# EAGLE design lipolski (EAGLE 7.7.0)
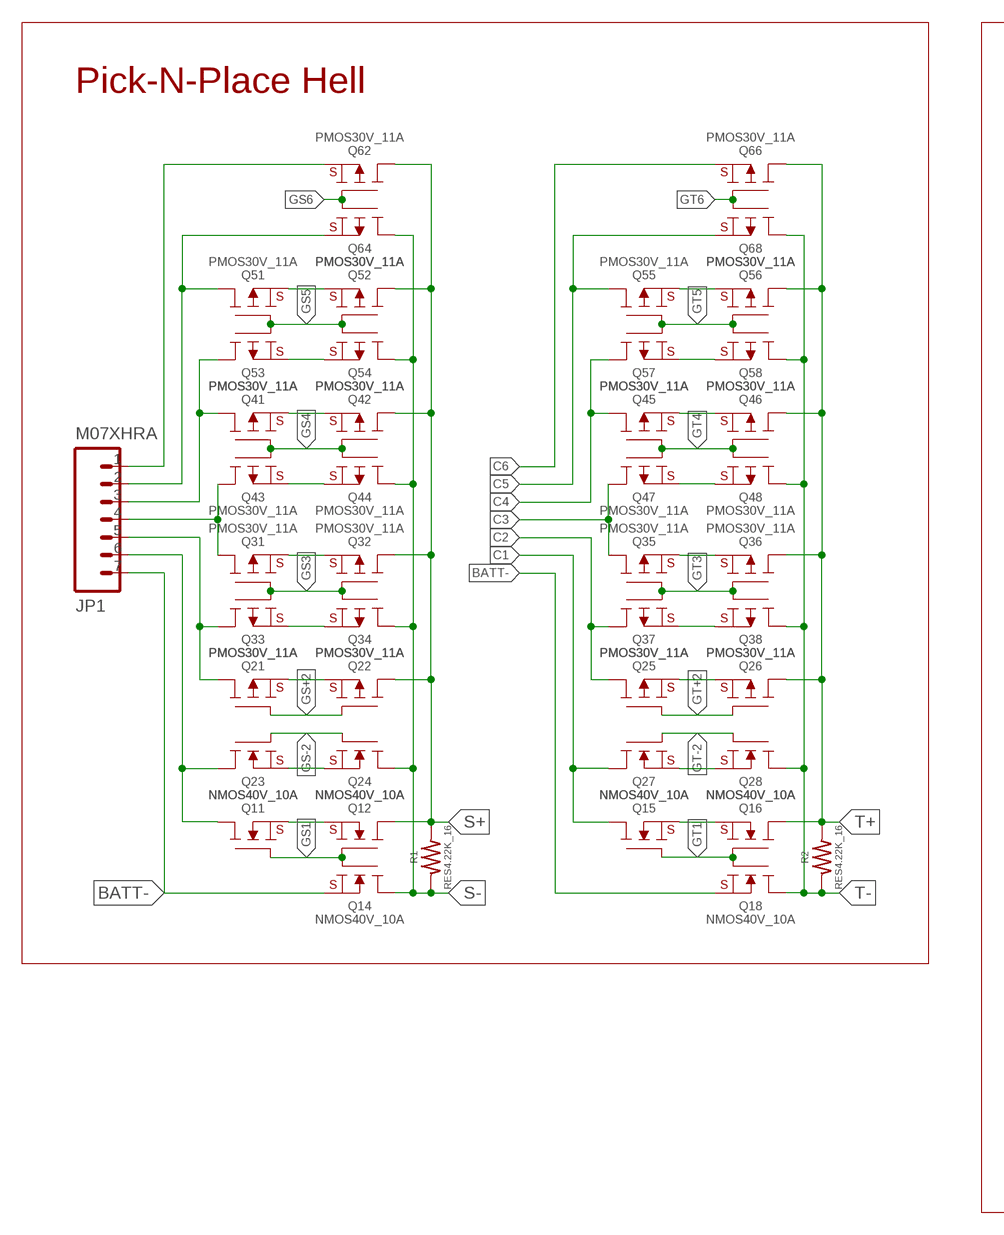
[diagram p0: schematic, sheet 1, part 1 of 2]
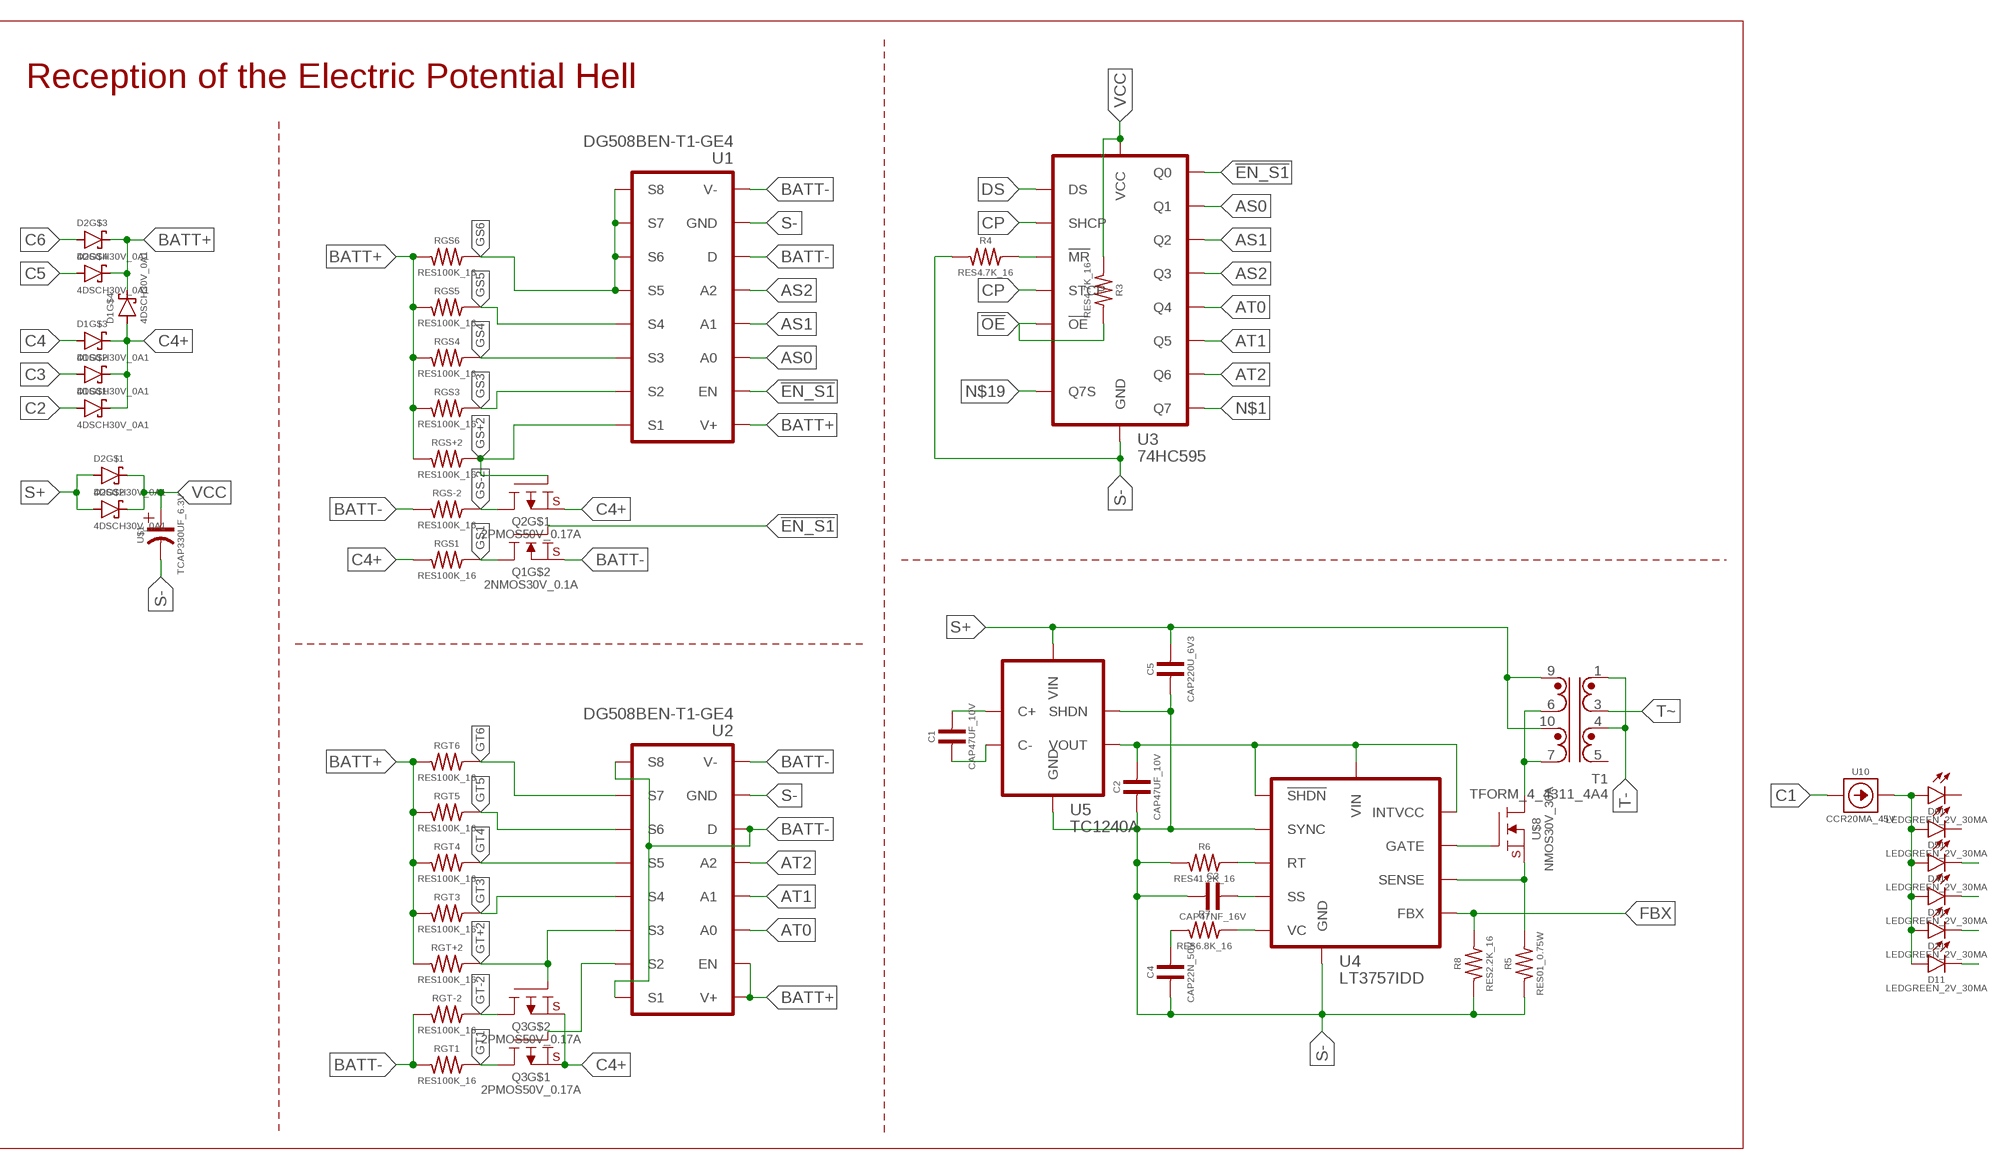
[diagram p1: schematic, sheet 1, part 2 of 2]

## Parts
C1  CAP47UF_10V  [0805]
C2  CAP47UF_10V  [0805]
C3  CAP47NF_16V  [0201P]
C4  CAP22N_50V  [0402]
C5  CAP220U_6V3  [1210]
D1  4DSCH30V_0A1  [8-HMD]
D2  4DSCH30V_0A1  [8-HMD]
D11  LEDGREEN_2V_30MA  [0603+]
D21  LEDGREEN_2V_30MA  [0603+]
D31  LEDGREEN_2V_30MA  [0603+]
D41  LEDGREEN_2V_30MA  [0603+]
D51  LEDGREEN_2V_30MA  [0603+]
D61  LEDGREEN_2V_30MA  [0603+]
JP1  M07XHRA  [XH07-RA]
Q1  2NMOS30V_0.1A  [SOT-666]
Q2  2PMOS50V_0.17A  [SOT-666]
Q3  2PMOS50V_0.17A  [SOT-666]
Q11  NMOS40V_10A  [6-POWERWDFN]
Q12  NMOS40V_10A  [6-POWERWDFN]
Q14  NMOS40V_10A  [6-POWERWDFN]
Q15  NMOS40V_10A  [6-POWERWDFN]
Q16  NMOS40V_10A  [6-POWERWDFN]
Q18  NMOS40V_10A  [6-POWERWDFN]
Q21  PMOS30V_11A  [6-POWERWDFN]
Q22  PMOS30V_11A  [6-POWERWDFN]
Q23  NMOS40V_10A  [6-POWERWDFN]
Q24  NMOS40V_10A  [6-POWERWDFN]
Q25  PMOS30V_11A  [6-POWERWDFN]
Q26  PMOS30V_11A  [6-POWERWDFN]
Q27  NMOS40V_10A  [6-POWERWDFN]
Q28  NMOS40V_10A  [6-POWERWDFN]
Q31  PMOS30V_11A  [6-POWERWDFN]
Q32  PMOS30V_11A  [6-POWERWDFN]
Q33  PMOS30V_11A  [6-POWERWDFN]
Q34  PMOS30V_11A  [6-POWERWDFN]
Q35  PMOS30V_11A  [6-POWERWDFN]
Q36  PMOS30V_11A  [6-POWERWDFN]
Q37  PMOS30V_11A  [6-POWERWDFN]
Q38  PMOS30V_11A  [6-POWERWDFN]
Q41  PMOS30V_11A  [6-POWERWDFN]
Q42  PMOS30V_11A  [6-POWERWDFN]
Q43  PMOS30V_11A  [6-POWERWDFN]
Q44  PMOS30V_11A  [6-POWERWDFN]
Q45  PMOS30V_11A  [6-POWERWDFN]
Q46  PMOS30V_11A  [6-POWERWDFN]
Q47  PMOS30V_11A  [6-POWERWDFN]
Q48  PMOS30V_11A  [6-POWERWDFN]
Q51  PMOS30V_11A  [6-POWERWDFN]
Q52  PMOS30V_11A  [6-POWERWDFN]
Q53  PMOS30V_11A  [6-POWERWDFN]
Q54  PMOS30V_11A  [6-POWERWDFN]
Q55  PMOS30V_11A  [6-POWERWDFN]
Q56  PMOS30V_11A  [6-POWERWDFN]
Q57  PMOS30V_11A  [6-POWERWDFN]
Q58  PMOS30V_11A  [6-POWERWDFN]
Q62  PMOS30V_11A  [6-POWERWDFN]
Q64  PMOS30V_11A  [6-POWERWDFN]
Q66  PMOS30V_11A  [6-POWERWDFN]
Q68  PMOS30V_11A  [6-POWERWDFN]
R1  RES4.22K_16  [0402]
R2  RES4.22K_16  [0402]
R3  RES4.7K_16  [0402]
R4  RES4.7K_16  [0402]
R5  RES01_0.75W  [1206]
R6  RES41.2K_16  [0402]
R7  RES6.8K_16  [0402]
R8  RES2.2K_16  [0402]
RGS1  RES100K_16  [0402]
RGS3  RES100K_16  [0402]
RGS4  RES100K_16  [0402]
RGS5  RES100K_16  [0402]
RGS6  RES100K_16  [0402]
RGS+2  RES100K_16  [0402]
RGS-2  RES100K_16  [0402]
RGT1  RES100K_16  [0402]
RGT3  RES100K_16  [0402]
RGT4  RES100K_16  [0402]
RGT5  RES100K_16  [0402]
RGT6  RES100K_16  [0402]
RGT+2  RES100K_16  [0402]
RGT-2  RES100K_16  [0402]
T1  TFORM_4_4311_4A4  [EPQ13]
U1  DG508BEN-T1-GE4  [MINIQFN-16L]
U2  DG508BEN-T1-GE4  [MINIQFN-16L]
U3  74HC595  [16-VFQFN]
U4  LT3757IDD  [10-WFDFN]
U5  TC1240A  [SOT-23-6]
U10  CCR20MA_45V  [SOD-123]
U$1  TCAP330UF_6.3V  [1210+]
U$8  NMOS30V_30A  [8-POWERWDFN]

## Nets
!EN_S1: Q1.5(G) U1.16(EN) U3.15(Q0)
!OE: R3.2 U3.13(!OE)
AS0: U1.15(A0) U3.1(Q1)
AS1: U1.14(A1) U3.2(Q2)
AS2: U1.13(A2) U3.3(Q3)
AT0: U2.15(A0) U3.4(Q4)
AT1: U2.14(A1) U3.5(Q5)
AT2: U2.13(A2) U3.6(Q6)
BATT+: D1.5(C) D2.5(C) D2.6(C) RGS3.1 RGS4.1 RGS5.1 RGS6.1 RGS+2.1 RGT3.1 RGT4.1 RGT5.1 RGT6.1 RGT+2.1 U1.11(V+) U2.11(V+) U2.16(EN)
BATT-: JP1.7 Q1.4(S) Q14.S Q18.S RGS-2.1 RGT1.1 RGT-2.1 U1.1(V-) U1.6(D) U2.1(V-) U2.2(S1) U2.6(D) U2.7(S8)
C1: JP1.6 Q11.D Q15.D Q23.D Q27.D U10.A
C2: D1.1(A) JP1.5 Q21.D Q25.D Q33.D Q37.D
C3: D1.2(A) JP1.4 Q31.D Q35.D Q43.D Q47.D
C4: D1.3(A) JP1.3 Q41.D Q45.D Q53.D Q57.D
C4+: D1.4(A) D1.6(C) D1.7(C) D1.8(C) Q2.1(S) Q3.1(S) Q3.4(S) RGS1.1
C5: D2.4(A) JP1.2 Q51.D Q55.D Q64.S Q68.S
C6: D2.3(A) JP1.1 Q62.S Q66.S
CP: U3.11(SHCP) U3.12(STCP)
DS: U3.14(DS)
FBX: R8.2 U4.2(FBX)
GS1: Q1.3(D) Q11.G Q12.G Q14.G RGS1.2
GS3: Q31.G Q32.G Q33.G Q34.G RGS3.2 U1.3(S2)
GS4: Q41.G Q42.G Q43.G Q44.G RGS4.2 U1.4(S3)
GS5: Q51.G Q52.G Q53.G Q54.G RGS5.2 U1.5(S4)
GS6: Q62.G Q64.G RGS6.2 U1.7(S8) U1.8(S7) U1.9(S6) U1.10(S5)
GS+2: Q2.2(G) Q21.G Q22.G RGS+2.2 U1.2(S1)
GS-2: Q2.6(D) Q23.G Q24.G RGS-2.2
GT1: Q3.6(D) Q15.G Q16.G Q18.G RGT1.2
GT3: Q35.G Q36.G Q37.G Q38.G RGT3.2 U2.5(S4)
GT4: Q45.G Q46.G Q47.G Q48.G RGT4.2 U2.10(S5)
GT5: Q55.G Q56.G Q57.G Q58.G RGT5.2 U2.9(S6)
GT6: Q66.G Q68.G RGT6.2 U2.8(S7)
GT+2: Q3.5(G) Q25.G Q26.G RGT+2.2 U2.4(S3)
GT-2: Q3.3(D) Q27.G Q28.G RGT-2.2
N$1: U3.7(Q7)
N$2: R4.2 U3.10(!MR)
N$3: R6.2 U4.4(RT)
N$4: D11.A D21.A D31.A D41.A D51.A D61.A U10.C
N$5: U4.7(GATE) U$8.G
N$6: C3.2 U4.3(SS)
N$7: R5.2 U4.6(SENSE) U$8.S
N$8: C1.2 U5.6(C+)
N$9: C1.1 U5.3(C-)
N$10: T1.6 T1.7 U$8.D
N$12: R7.2 U4.1(VC)
N$13: D41.C
N$14: D31.C
N$15: D21.C
N$16: D11.C
N$17: C4.2 R7.1
N$19: U3.9(Q7S)
N$23: Q3.2(G) U2.3(S2)
S+: C5.2 D2.1(A) D2.2(A) Q12.D Q22.D Q32.D Q42.D Q52.D Q62.D R1.2 T1.9 T1.10 U5.1(VIN)
S-: C2.1 C3.1 C4.1 C5.1 Q14.D Q24.D Q34.D Q44.D Q54.D Q64.D R1.1 R4.1 R5.1 R6.1 R8.1 U1.12(GND) U2.12(GND) U3.8(GND) U3.PAD(GND) U4.5(SYNC) U4.PAD(GND) U5.2(GND) U5.4(SHDN) U$1.C
SS+1: Q11.S Q12.S
SS+2: Q21.S Q22.S
SS+3: Q31.S Q32.S
SS+4: Q41.S Q42.S
SS+5: Q51.S Q52.S
SS-2: Q23.S Q24.S
SS-3: Q33.S Q34.S
SS-4: Q43.S Q44.S
SS-5: Q53.S Q54.S
ST+1: Q15.S Q16.S
ST+2: Q25.S Q26.S
ST+3: Q35.S Q36.S
ST+4: Q45.S Q46.S
ST+5: Q55.S Q56.S
ST-2: Q27.S Q28.S
ST-3: Q37.S Q38.S
ST-4: Q47.S Q48.S
ST-5: Q57.S Q58.S
T+: Q16.D Q26.D Q36.D Q46.D Q56.D Q66.D R2.2
T-: Q18.D Q28.D Q38.D Q48.D Q58.D Q68.D R2.1 T1.1 T1.4
T~: T1.3
VCC: D2.7(C) D2.8(C) R3.1 U3.16(VCC) U$1.A
VCC_REG: C2.2 U4.8(INTVCC) U4.9(!SHDN) U4.10(VIN) U5.5(VOUT)
Unconnected: D51.C D61.C Q1.1(S) Q1.2(G) Q1.6(D) Q2.3(D) Q2.4(S) Q2.5(G) T1.5

## Notes on the sheet
- Pick-N-Place Hell | Reception of the Electric Potential Hell

## Library data of the parts
C1 C2 = dubec:CAP: Ceramic capacitor; DIGIKEY_PART_#: 445-8239-1-ND; MANUFACTURER: TDK Corporation; MFG_PART_#: C2012X5R1A476M125AC; TEMP: X5R; TOLERANCE: ±20%; USD: 0.93
C3 = dubec:CAP: Ceramic capacitor; DIGIKEY_PART_#: 587-1225-1-ND; EURO: 3.51/1000; MANUFACTURER: Taiyo Yuden; MFG_PART_#: EMK105B7473KV-F; TEMP: X7R; TOLERANCE: ±10%
C4 = dubec:CAP: Ceramic capacitor; DIGIKEY_PART_#: 490-3884-1-ND; EURO: 4.32/1000; MANUFACTURER: Murata Electronics North America; MFG_PART_#: GRM155R71H223KA12D; TEMP: X7R; TOLERANCE: ±10%
C5 = dubec:CAP: Ceramic capacitor; DIGIKEY_PART_#: 1276-3375-1-ND; EURO: 20.40/25; MANUFACTURER: Samsung Electro-Mechanics America, Inc.; MFG_PART_#: CL32A227MQVNNNE; TEMP: X5R, -55°C ~ 85°C; TOLERANCE: ±20%
D1 D2 = dubec:4DSCH: Array of 4 independent Schottky diodes; DIGIKEY_PART_#: RB521ZS8A30TE61CT-ND; EURO: 4.70/10; MANUFACTURER: Rohm Semiconductor; MFG_PART_#: RB521ZS8A30TE61
D11 D21 D31 D41 D51 D61 = dubec:LED: LED; DIGIKEY_PART_#: 160-1435-1-ND; EURO: 3.26/25; LUM: 35mcd; MANUFACTURER: Lite-On Inc.; MFG_PART_#: LTST-C190KGKT
JP1 = dubec:M07; DIGIKEY_PART_#: 455-2240-ND; EURO: 3.82/10; MANUFACTURER: JST Sales America Inc.; MFG_PART_#: S7B-XH-A(LF)(SN)
Q1 = dubec:2NMOS: Dual N-channel MOSFET; DIGIKEY_PART_#: FC6943010RCT-ND; EURO: 6.17/100; MANUFACTURER: Panasonic Electronic Components; MFG_PART_#: FC6943010R; POWER: 0.125W; RDS: 8 Ohm @ 10mA, 4V
Q2 Q3 = dubec:2PMOS: Dual P-channel enhancement mode MOSFET; DIGIKEY_PART_#: 568-10474-1-ND; EURO: 2.70/10; MANUFACTURER: NXP Semiconductors; MFG_PART_#: BSS84AKV,115; POWER: 0.5W; RDS: 7.5 Ohm @ 100mA, 10V; TEMP: -55°C ~ 150°C (TJ)
Q11 Q12 Q14-Q16 Q18 Q23 Q24 Q27 Q28 = dubec:NMOS: N-channel MOSFET; DIGIKEY_PART_#: FDMA7670CT-ND; EURO: 38.24/100; MANUFACTURER: Fairchild Semiconductor; MFG_PART_#: FDMA7670; POWER: 0.9W; RDS: 15 mOhm @ 11A, 10V
Q21 Q22 Q25 Q26 Q31-Q38 Q41-Q48 Q51-Q58 Q62 Q64 Q66 Q68 = dubec:PMOS: Single P-Channel MOSFET; DIGIKEY_PART_#: FDMA6676PZCT-ND; EURO: 49.94/100; MANUFACTURER: Fairchild Semiconductor; MFG_PART_#: FDMA6676PZ; POWER: 0.9W; RDS: 13.5 mOhm @ 11A, 10V
R1 R2 = dubec:RES: Resistor; DIGIKEY_PART_#: 541-4.22KLCT-ND; MANUFACTURER: Vishay Dale; MFG_PART_#: CRCW04024K22FKED; TEMP: ±100ppm/°C; TOLERANCE: ±1%; USD: 0.78/10
R3 R4 = dubec:RES: Resistor; DIGIKEY_PART_#: 541-4.70KLCT-ND; EURO: 2.01/50; MANUFACTURER: Vishay Dale; MFG_PART_#: CRCW04024K70FKED; TEMP: ±100ppm/°C; TOLERANCE: ±1%
R5 = dubec:RES: Resistor; DIGIKEY_PART_#: 408-1570-1-ND; EURO: 6.76/25; MANUFACTURER: Susumu; MFG_PART_#: KRL1632E-M-R010-F-T5; TEMP: ±50ppm/°C; TOLERANCE: ±1%
R6 = dubec:RES: Resistor; DIGIKEY_PART_#: 541-41.2KLCT-ND; MANUFACTURER: Vishay Dale; MFG_PART_#: CRCW040241K2FKED; TEMP: ±100ppm/°C; TOLERANCE: ±1%; USD: 2.01/50
R7 = dubec:RES: Resistor; DIGIKEY_PART_#: 541-6.80KLCT-ND; EURO: 1.17/100; MANUFACTURER: Vishay Dale; MFG_PART_#: CRCW04026K80FKED; TEMP: ±100ppm/°C; TOLERANCE: ±1%
R8 = dubec:RES: Resistor; DIGIKEY_PART_#: 541-2.20KLCT-ND; MANUFACTURER: Vishay Dale; MFG_PART_#: CRCW04022K20FKED; TEMP: ±100ppm/°C; TOLERANCE: ±1%; USD: 2.11/50
RGS1 RGS3-RGS6 RGS+2 RGS-2 RGT1 RGT3-RGT6 RGT+2 RGT-2 = dubec:RES: Resistor; DIGIKEY_PART_#: 541-100KLCT-ND; EURO: 1.17/100; MANUFACTURER: Vishay Dale; MFG_PART_#: CRCW0402100KFKED; TEMP: ±100ppm/°C; TOLERANCE: ±1%
T1 = dubec:TFORM_4_4: 2P-2S transformer; DIGIKEY_PART_#: 732-6198-1-ND; EURO: 7.82; FREQ: 200 ~ 400kHz; IND: 21µH @ 100kHz; MANUFACTURER: Wurth Electronics Inc; MFG_PART_#: 7491195501
U1 U2 = dubec:DG508B: Vishay Siliconix DG508B - 8-Channel CMOS Analog Multiplexer; EURO: 16.90/10; MANUFACTURER: Vishay Siliconix; MFG_PART_#: DG508BEN-T1-GE4; MOUSER_PART_#: 78-DG508BEN-T1-GE4; RON: 380 Ohm; TEMP: -40°C ~ 125°C (TA); VSS: ±5 V ~ 20 V
U3 = dubec:74HC595: NXP 74HC595 - 8-bit serial-in, serial or parallel-out shift register with output latches; 3-state; DIGIKEY_PART_#: 568-2719-1-ND; EURO: 19.61/100; MANUFACTURER: NXP Semiconductors; MFG_PART_#: 74HC595BQ,115; TEMP: -40°C ~ 125°C; VCC: 2 V ~ 6 V
U4 = dubec:LT3757: LT3757/LT3757A Boost, Flyback, SEPIC Regulator Positive and Negative Output Step-Up, Step-Up/Step-Down DC-DC Controller; DIGIKEY_PART_#: LT3757IDD#PBF-ND; EURO: 71.25/25; MANUFACTURER: Linear Technology; MFG_PART_#: LT3757IDD#PBF; TEMP: -40°C ~ 125°C (TJ)
U5 = dubec:TC1240: TC1240 - Charge Pump Switching Regulator IC Positive Fixed 2Vin 1 Output 40mA; DIGIKEY_PART_#: TC1240AECHCT-ND; EURO: 15.53/25; FREQUENCY: 80kHz; MANUFACTURER: Microchip Technology; MFG_PART_#: TC1240AECHTR; TEMP: -40°C ~ 85°C (TA); VIN: 2.5-5.5V
U10 = dubec:CCR; DIGIKEY_PART_#: NSI45020T1GOSCT-ND; EURO: 3.36/10; MANUFACTURER: ON Semiconductor; MFG_PART_#: NSI45020T1G; TOLERANCE: ±15%
U$1 = dubec:TCAP; DIGIKEY_PART_#: 478-8407-1-ND; ESR: 600mOhm; EURO: 16.56/10; MANUFACTURER: AVX Corporation; MFG_PART_#: F950J337KBAAQ2; TEMP: -55°C ~ 125°C; TOLERANCE: ±10%
U$8 = dubec:NMOS: N-channel MOSFET; DIGIKEY_PART_#: FDMC8010ET30CT-ND; EURO: 1.58; MANUFACTURER: Fairchild Semiconductor; MFG_PART_#: FDMC8010ET30; POWER: 2.8W; RDS: 1.3 mOhm @ 30A, 10V; TEMP: -55°C ~ 175°C (TJ)

## Board
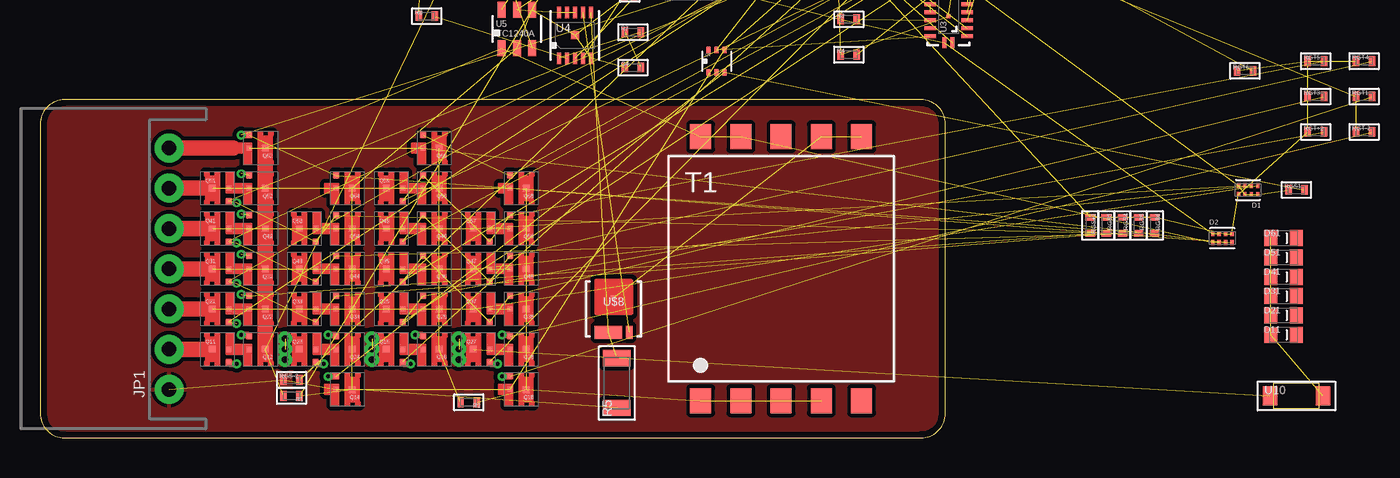
[diagram p2: board, top side]
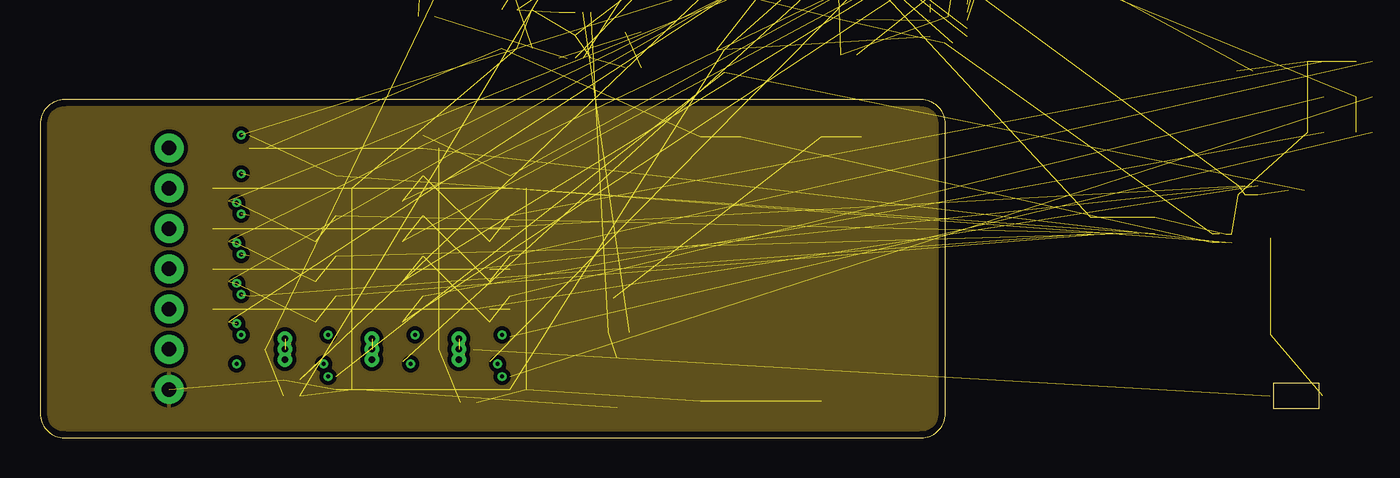
[diagram p3: board, inner layer Route2]
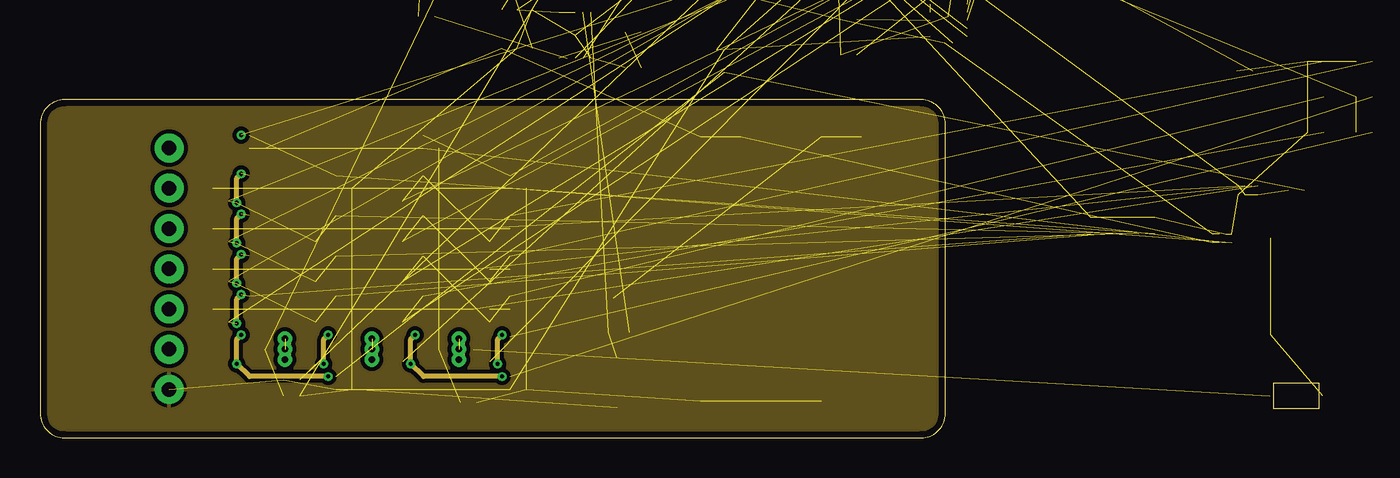
[diagram p4: board, inner layer Route15]
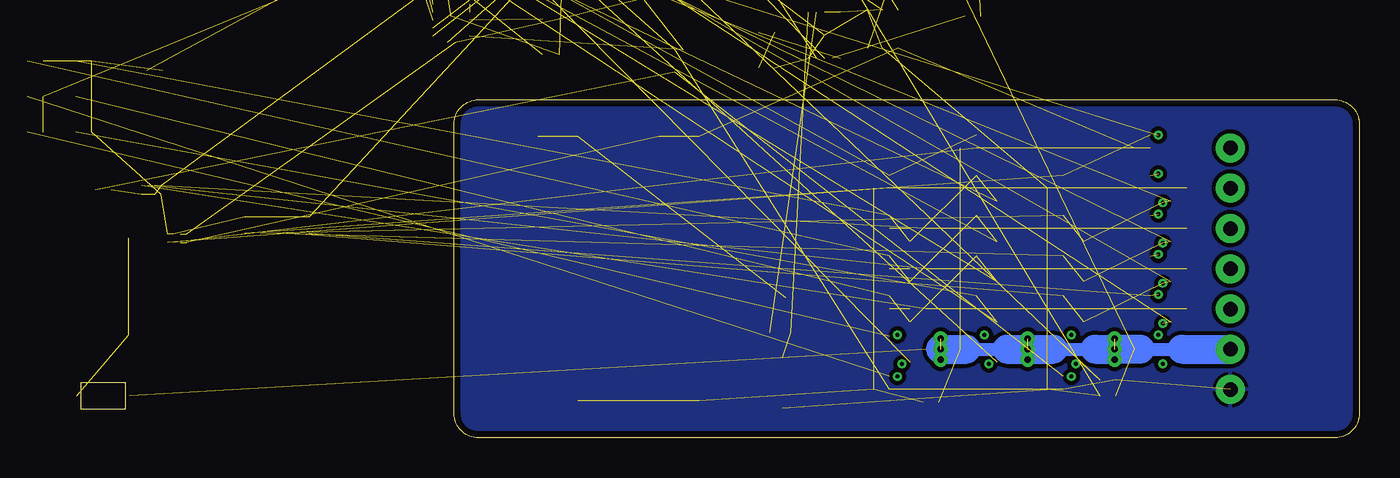
[diagram p5: board, bottom side, seen from below]

Size 56.2 x 21 mm. Coordinates in mm from the lower left corner, seen from the top.
Outline: 0,1.5 arc90 1.5,0 54.7,0 arc90 56.2,1.5 56.2,19.5 arc90 54.7,21 1.5,21 arc90 0,19.5 0,1.5
Copper layers (1+2*15+16): Top 1mil / dielectric 0.2mm / Route2 0.5mil / dielectric 1.2mm / Route15 0.5mil / dielectric 0.2mm / Bottom 1mil
Design rules "default *": minimum track width 0.15mm, minimum drill 0.25mm, track to track 0.15mm, track to pad 0.15mm, pad to pad 0.15mm, via to via 0.15mm, smd to smd 0mil, copper to edge 0.4mm, drill to drill 0.2mm, minimum pad ring 0.15mm, minimum via ring 0.15mm, stop-mask expansion 0.01mm, vias tented up to drill 0.5mm, thermal gap 0.2mm

### Footprints (pad centres in the part's own frame; a part is rotated, then mirrored left to right if it is on the bottom)
0805 = smd 0.8 x 1.4: 1 -0.9,0; 2 0.9,0
0201P = smd 0.3 x 0.35: 1 -0.3,0; 2 0.3,0
0402 = smd 0.4 x 0.6: 1 -0.5,0; 2 0.5,0
1210 = smd 1.6 x 2.7: 1 -1.4,0; 2 1.4,0
8-HMD = smd 0.2 x 0.3: 1 -0.6,-0.275; 2 -0.2,-0.275; 3 0.2,-0.275; 4 0.6,-0.275; 5 0.6,0.275; 6 0.2,0.275; 7 -0.2,0.275; 8 -0.6,0.275
0603+ = smd 0.8 x 1: A -0.8,0; C 0.8,0
XH07-RA = drill 0.9 pad 1.8: 1 7.5,0; 2 5,0; 3 2.5,0; 4 0,0; 5 -2.5,0; 6 -5,0; 7 -7.5,0
SOT-666 = smd 0.25 x 0.4: 1 -0.5,-0.7; 2 0,-0.7; 3 0.5,-0.7; 4 0.5,0.7; 5 0,0.7; 6 -0.5,0.7
6-POWERWDFN = smd 0.4 x 0.4: D -0.3,0 | smd 0.3 x 0.3: G 0.7,-0.8; S 0.7,0
1206 = smd 1 x 1.7: 1 -1.55,0; 2 1.55,0
EPQ13 = smd 1.3 x 1.55: 1 -5,-8.2; 2 -2.5,-8.2; 3 0,-8.2; 4 2.5,-8.2; 5 5,-8.2; 6 5,8.2; 7 2.5,8.2; 8 0,8.2; 9 -2.5,8.2; 10 -5,8.2
MINIQFN-16L = smd 0.55 x 0.2: 1 -0.775,0.6 | smd 0.45 x 0.2: 2 -0.825,0.2; 3 -0.825,-0.2; 4 -0.825,-0.6; 9 0.825,-0.6; 10 0.825,-0.2; 11 0.825,0.2; 12 0.825,0.6 | smd 0.2 x 0.45: 5 -0.6,-1.225; 6 -0.2,-1.225; 7 0.2,-1.225; 8 0.6,-1.225; 13 0.6,1.225; 14 0.2,1.225; 15 -0.2,1.225; 16 -0.6,1.225
16-VFQFN = smd 0.7 x 0.25: 1 -1.65,-0.25; 8 1.65,-0.25; 9 1.65,0.25; 16 -1.65,0.25 | smd 0.25 x 0.7: 2 -1.25,-1.15; 3 -0.75,-1.15; 4 -0.25,-1.15; 5 0.25,-1.15; 6 0.75,-1.15; 7 1.25,-1.15; 10 1.25,1.15; 11 0.75,1.15; 12 0.25,1.15; 13 -0.25,1.15; 14 -0.75,1.15; 15 -1.25,1.15 | smd 0.25 x 0.25: PAD 0,0
10-WFDFN = smd 0.25 x 0.7: 1 -1,-1.425; 2 -0.5,-1.425; 3 0,-1.425; 4 0.5,-1.425; 5 1,-1.425; 6 1,1.425; 7 0.5,1.425; 8 0,1.425; 9 -0.5,1.425; 10 -1,1.425 | smd 0.5 x 0.5: PAD 0,0
SOT-23-6 = smd 0.5 x 1: 1 -0.95,-1.2; 2 0,-1.2; 3 0.95,-1.2; 4 0.95,1.2; 5 0,1.2; 6 -0.95,1.2
SOD-123 = smd 0.9 x 1.2: A -1.65,0; C 1.65,0
1210+ = smd 1.2 x 2.7: A -1.2,0; C 1.2,0
8-POWERWDFN = smd 0.3 x 0.3: D 0,0.7 | smd 0.4 x 0.8: G 0.975,-1.45 | smd 1.7 x 0.8: S -0.325,-1.45

### Placement (x,y rotation side)
C1  29.6,29.6 0 top  (outside the outline)
C2  33.2,29.6 0 top  (outside the outline)
C3  36.6,27.4 0 top  (outside the outline)
C4  36.8,23 0 top
C5  25.2,31.8 0 top  (outside the outline)
D1  75,15.4 180 top  (outside the outline)
D2  73.4,12.4 0 top  (outside the outline)
D11  77.2,6.4 0 top  (outside the outline)
D21  77.2,7.6 0 top  (outside the outline)
D31  77.2,8.8 0 top  (outside the outline)
D41  77.2,10 0 top  (outside the outline)
D51  77.2,11.2 0 top  (outside the outline)
D61  77.2,12.4 0 top  (outside the outline)
JP1  8,10.5 90 top
Q1  42,23.4 0 top
Q2  45.4,30.4 0 top  (outside the outline)
Q3  52.4,30.8 0 top  (outside the outline)
Q11  11,5.5 0 top
Q12  13.68,5.5 180 top
Q14  19.07,3 180 top
Q15  21.8,5.5 0 top
Q16  24.48,5.5 180 top
Q18  29.88,3 180 top
Q21  11,8 0 top
Q22  13.68,8 180 top
Q23  16.4,5.5 0 top
Q24  19.07,5.5 180 top
Q25  21.8,8 0 top
Q26  24.48,8 180 top
Q27  27.2,5.5 0 top
Q28  29.88,5.5 180 top
Q31  11,10.5 0 top
Q32  13.68,10.5 180 top
Q33  16.4,8 0 top
Q34  19.07,8 180 top
Q35  21.8,10.5 0 top
Q36  24.48,10.5 180 top
Q37  27.2,8 0 top
Q38  29.88,8 180 top
Q41  11,13 0 top
Q42  13.68,13 180 top
Q43  16.4,10.5 0 top
Q44  19.07,10.5 180 top
Q45  21.8,13 0 top
Q46  24.48,13 180 top
Q47  27.2,10.5 0 top
Q48  29.88,10.5 180 top
Q51  11,15.5 0 top
Q52  13.68,15.5 180 top
Q53  16.4,13 0 top
Q54  19.07,13 180 top
Q55  21.8,15.5 0 top
Q56  24.48,15.5 180 top
Q57  27.2,13 0 top
Q58  29.88,13 180 top
Q62  13.68,18 180 top
Q64  19.07,15.5 180 top
Q66  24.48,18 180 top
Q68  29.88,15.5 180 top
R1  15.6,2.6 180 top
R2  26.6,2.2 180 top
R3  50.2,26 0 top  (outside the outline)
R4  50.2,23.8 0 top
R5  35.8,3.4 90 top
R6  36.8,29.2 0 top  (outside the outline)
R7  36.8,25.2 0 top  (outside the outline)
R8  24,26.2 0 top  (outside the outline)
RGS1  78,15.4 0 top  (outside the outline)
RGS3  66.2,13.2 270 top  (outside the outline)
RGS4  67.2,13.2 270 top  (outside the outline)
RGS5  68.2,13.2 270 top  (outside the outline)
RGS6  69.2,13.2 270 top  (outside the outline)
RGS+2  65.2,13.2 270 top  (outside the outline)
RGS-2  15.6,3.6 0 top
RGT1  82.2,21.2 0 top  (outside the outline)
RGT3  79.2,21.2 0 top  (outside the outline)
RGT4  82.2,23.4 0 top  (outside the outline)
RGT5  79.2,23.4 0 top  (outside the outline)
RGT6  74.8,22.8 0 top  (outside the outline)
RGT+2  79.2,19 0 top  (outside the outline)
RGT-2  82.2,19 0 top  (outside the outline)
T1  46,10.5 0 top
U1  48.6,30.6 0 top  (outside the outline)
U2  58.6,31 180 top  (outside the outline)
U3  56.4,26.2 90 top  (outside the outline)
U4  33.2,25 0 top
U5  29.6,25.4 0 top  (outside the outline)
U10  78,2.6 0 top  (outside the outline)
U$1  40.4,28.6 0 top  (outside the outline)
U$8  35.6,8 0 top

### Tracks (layer width: path | path; a pad name or v marks a point on that pad's centre or on a via)
!EN_S1  (2 unrouted)
!OE  (1 unrouted)
AS0  (1 unrouted)
AS1  (1 unrouted)
AS2  (1 unrouted)
AT0  (1 unrouted)
AT1  (1 unrouted)
AT2  (1 unrouted)
BATT+  (15 unrouted)
BATT-  (12 unrouted)
  pour Top (isolate 0.25): 0,0 0,21.4 56.6,21.4 56.6,0
  pour Bottom (isolate 0.25): 0,0 0,22.6 57.8,22.6 57.8,0
  pour Route2 (isolate 0.25): 0,0 0,21.8 57,21.8 57,0
  pour Route15 (isolate 0.25): 0,0 0,22.2 57.4,22.2 57.4,0
C1  (via drill 0.4 pad 0.9)  (4 unrouted)
  Top 0.4: v15.2,5.5 Q23.D | v26,5.5 Q27.D | Q15.D v20.6,5.5
  Top 0.95: JP1.6 Q11.D
  Route2 0.7: v20.6,6.15 v20.6,4.85 | v15.2,6.15 v15.2,4.85 | v26,6.15 v26,4.85
  Route15 0.7: v20.6,6.15 v20.6,4.85 | v15.2,6.15 v15.2,4.85 | v26,6.15 v26,4.85
  Bottom 0.8: 19,5.5 16.4,5.5 | 13.6,5.5 11,5.5 | 24.4,5.5 21.88,5.5
  Bottom 1.8: 19,5.5 v20.6,5.5 21.88,5.5 | 16.4,5.5 v15.2,5.5 13.6,5.5 | 11,5.5 JP1.6 | v26,5.5 24.4,5.5
  pour Top: 14.85,4.5 14.85,6.5 15.65,6.5 15.65,4.5
  pour Top: 20.25,4.5 20.25,6.5 21.05,6.5 21.05,4.5
  pour Top: 25.65,4.5 25.65,6.5 26.45,6.5 26.45,4.5
C2  (4 unrouted)
  Top 0.95: JP1.5 Q21.D
C3  (4 unrouted)
  Top 0.95: JP1.4 Q31.D
C4  (4 unrouted)
  Top 0.95: JP1.3 Q41.D
C4+  (7 unrouted)
C5  (4 unrouted)
  Top 0.95: JP1.2 Q51.D
C6  (2 unrouted)
  Top 0.4: 11.97,18 Q62.S
  Top 0.95: JP1.1 11.97,18
CP  (1 unrouted)
FBX  (1 unrouted)
GS1  (via drill 0.25)  (2 unrouted)
  Top 0.4: v12.47,6.4 12.88,6.4 Q12.G | v12.2,4.6 11.8,4.6 Q11.G | v17.88,3.8 Q14.G
  Route15 0.3: v12.47,6.4 12.2,6.12 v12.2,4.6 13,3.8 v17.88,3.8
GS3  (via drill 0.25)  (6 unrouted)
  Route15 0.3: v12.2,9.6 12.2,11.12 v12.47,11.4
GS4  (via drill 0.25)  (6 unrouted)
  Route15 0.3: v12.2,12.1 12.2,13.62 v12.47,13.9
GS5  (via drill 0.25)  (6 unrouted)
  Route15 0.3: v12.2,14.6 12.2,16.12 v12.47,16.4
GS6  (via drill 0.25)  (6 unrouted)
  Top 0.4: v12.47,18.8 Q62.G
GS+2  (via drill 0.25)  (5 unrouted)
  Route15 0.3: v12.2,7.1 12.2,8.62 v12.47,8.9
GS-2  (via drill 0.25)  (2 unrouted)
  Top 0.4: v17.88,6.4 18.27,6.4 Q24.G | v17.6,4.6 17.2,4.6 Q23.G
  Route15 0.3: v17.6,4.6 17.6,6.12 v17.88,6.4
GT1  (via drill 0.25)  (2 unrouted)
  Top 0.4: v23.27,6.4 23.68,6.4 Q16.G | v23,4.6 22.6,4.6 Q15.G | v28.68,3.8 Q18.G
  Route15 0.3: v23.27,6.4 23,6.12 v23,4.6 23.8,3.8 v28.68,3.8
GT3  (5 unrouted)
GT4  (5 unrouted)
GT5  (5 unrouted)
GT6  (3 unrouted)
GT+2  (4 unrouted)
GT-2  (via drill 0.25)  (2 unrouted)
  Top 0.4: v28.4,4.6 28,4.6 Q27.G | v28.68,6.4 29.07,6.4 Q28.G
  Route15 0.3: v28.4,4.6 28.4,6.12 v28.68,6.4
N$2  (1 unrouted)
N$3  (1 unrouted)
N$4  (6 unrouted)
N$5  (1 unrouted)
N$6  (1 unrouted)
N$7  (2 unrouted)
N$8  (1 unrouted)
N$9  (1 unrouted)
N$10  (2 unrouted)
N$12  (1 unrouted)
N$17  (1 unrouted)
N$23  (1 unrouted)
S+  (7 unrouted)
  Top 0.95: Q12.D Q22.D Q32.D Q42.D Q52.D Q62.D
S-  (23 unrouted)
SS+1
  Top 0.4: Q11.S Q12.S
SS+2  (1 unrouted)
SS+3  (1 unrouted)
SS+4  (1 unrouted)
SS+5  (1 unrouted)
SS-2
  Top 0.4: Q23.S Q24.S
SS-3  (1 unrouted)
SS-4  (1 unrouted)
SS-5  (1 unrouted)
ST+1
  Top 0.4: Q15.S Q16.S
ST+2  (1 unrouted)
ST+3  (1 unrouted)
ST+4  (1 unrouted)
ST+5  (1 unrouted)
ST-2
  Top 0.4: Q27.S Q28.S
ST-3  (1 unrouted)
ST-4  (1 unrouted)
ST-5  (1 unrouted)
T+  (6 unrouted)
T-  (8 unrouted)
VCC  (4 unrouted)
VCC_REG  (4 unrouted)